# EAGLE schematic test (EAGLE 8.4.1)
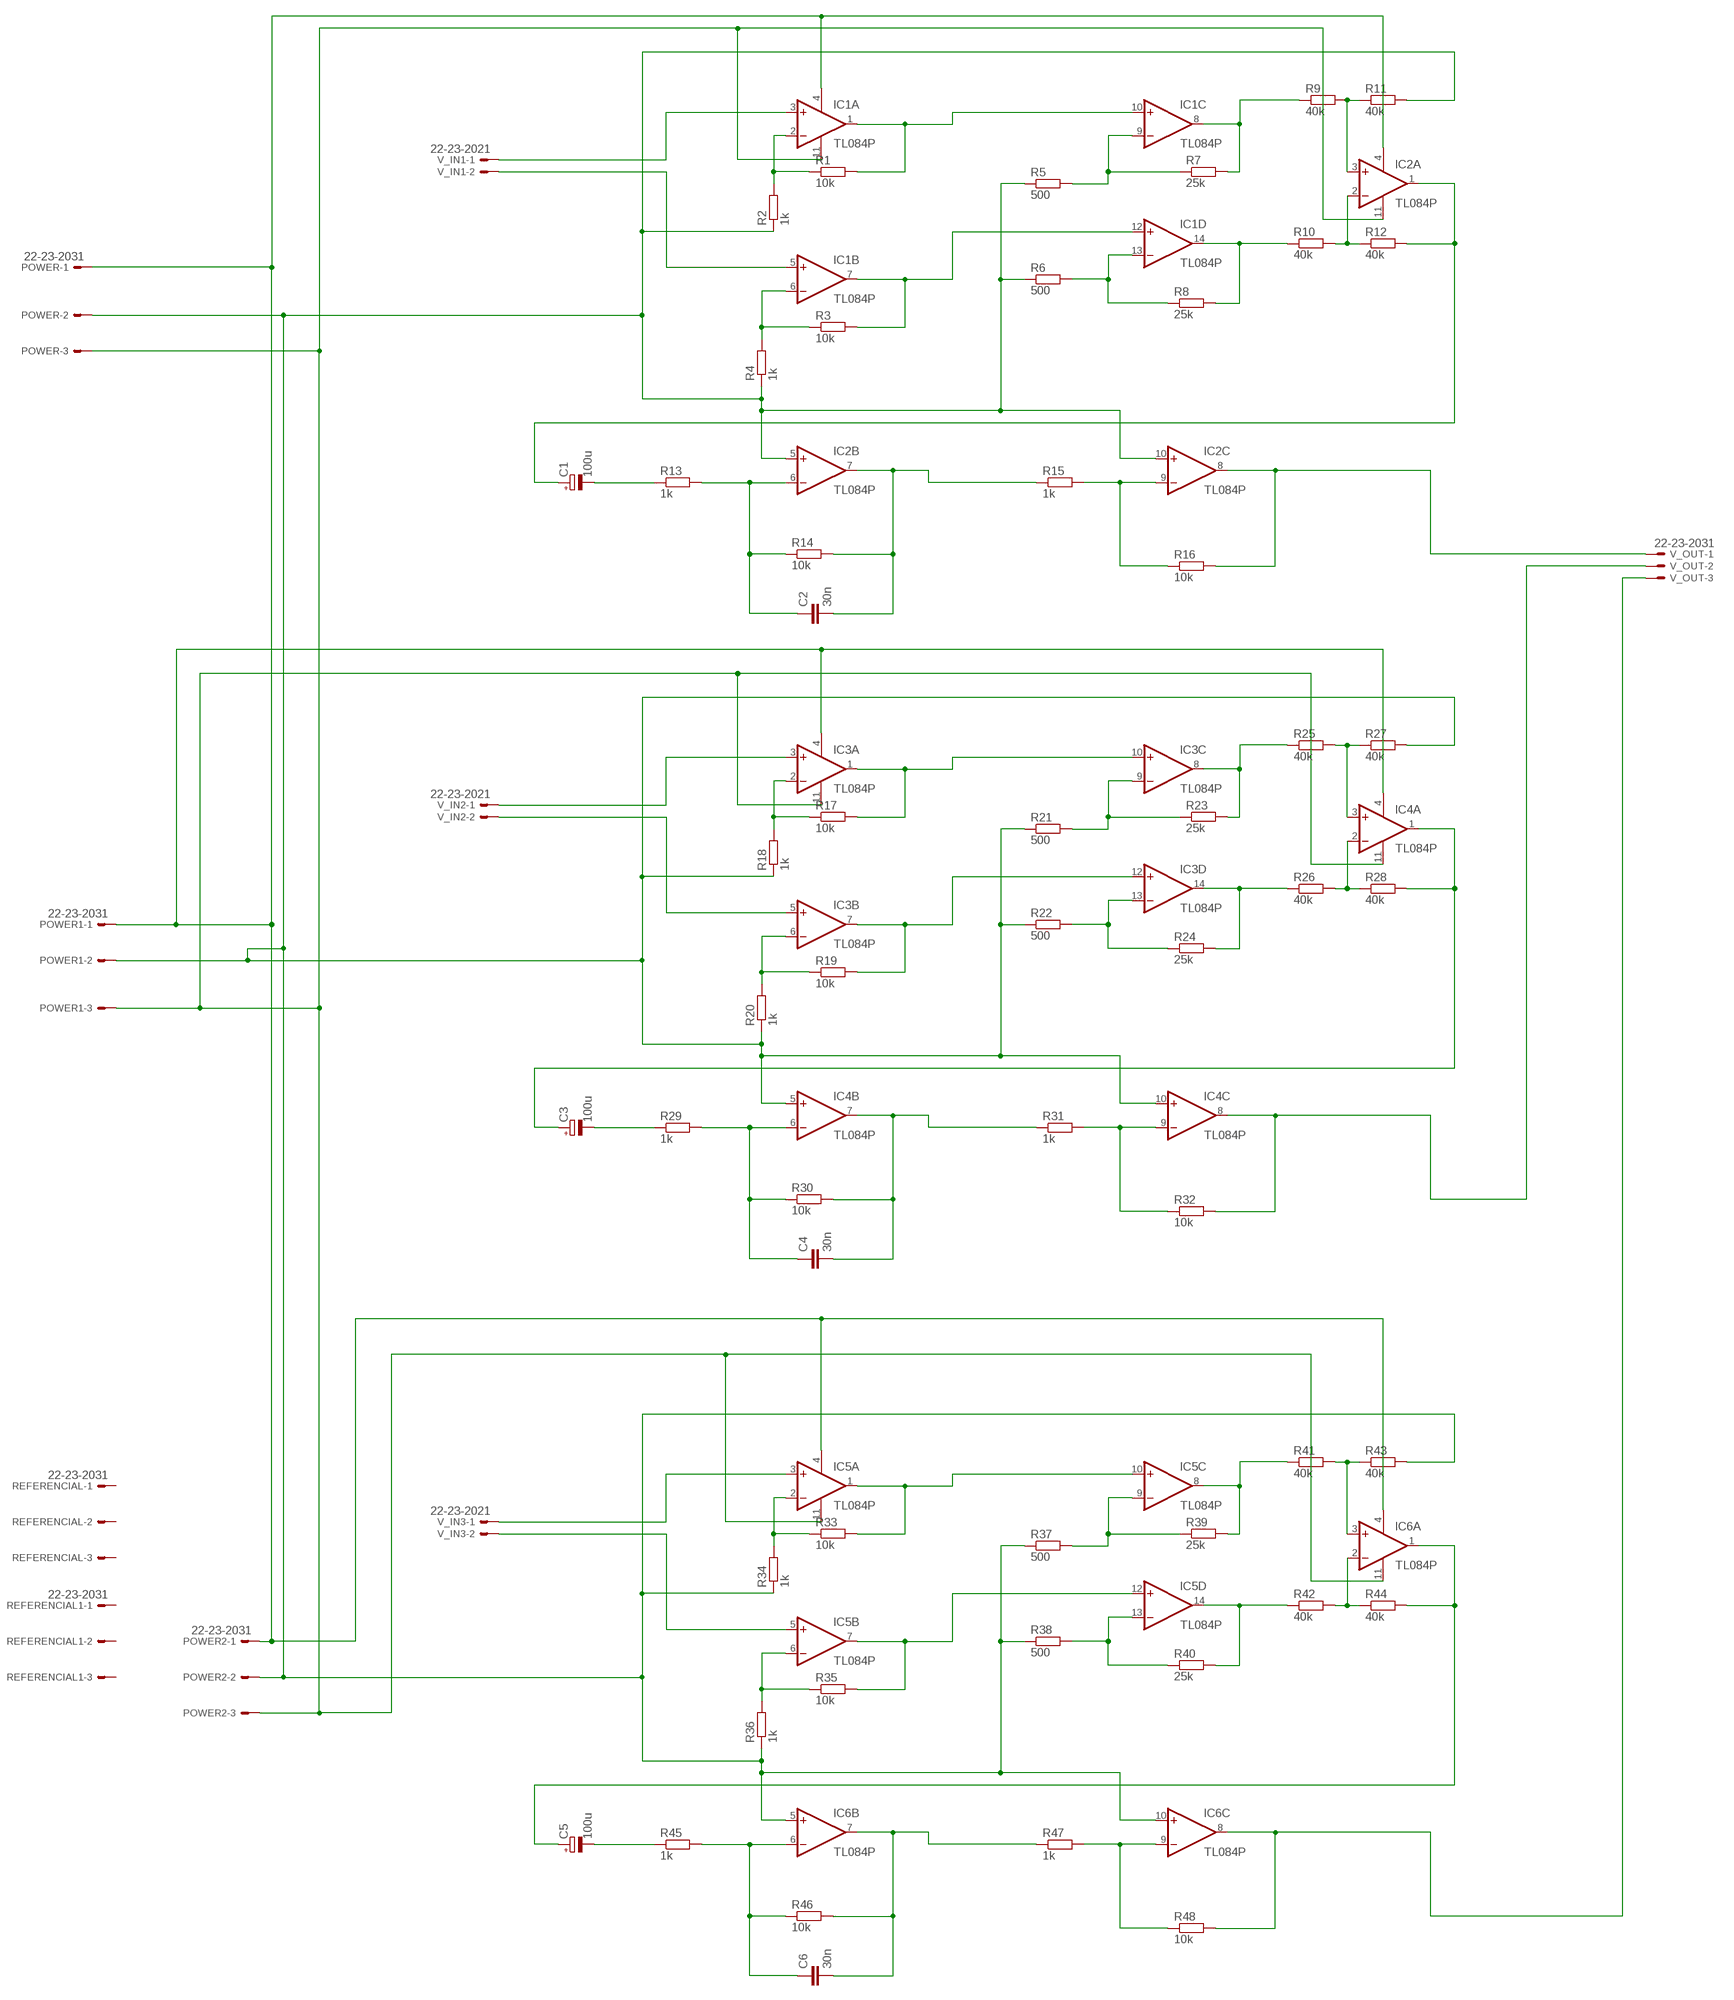
[diagram p0: schematic, sheet 1]

## Parts
C1  100u  CPOL-EUE3.5-8  [E3,5-8]
C2  30n  C-EU050-024X044  [C050-024X044]
C3  100u  CPOL-EUE3.5-8  [E3,5-8]
C4  30n  C-EU050-024X044  [C050-024X044]
C5  100u  CPOL-EUE3.5-8  [E3,5-8]
C6  30n  C-EU050-024X044  [C050-024X044]
IC1  TL084P  [DIL14]
IC2  TL084P  [DIL14]
IC3  TL084P  [DIL14]
IC4  TL084P  [DIL14]
IC5  TL084P  [DIL14]
IC6  TL084P  [DIL14]
POWER  22-23-2031  [22-23-2031]
POWER1  22-23-2031  [22-23-2031]
POWER2  22-23-2031  [22-23-2031]
R1  10k  R-EU_0207/10  [0207/10]
R2  1k  R-EU_0207/10  [0207/10]
R3  10k  R-EU_0207/10  [0207/10]
R4  1k  R-EU_0207/10  [0207/10]
R5  500  R-EU_0207/10  [0207/10]
R6  500  R-EU_0207/10  [0207/10]
R7  25k  R-EU_0207/10  [0207/10]
R8  25k  R-EU_0207/10  [0207/10]
R9  40k  R-EU_0207/10  [0207/10]
R10  40k  R-EU_0207/10  [0207/10]
R11  40k  R-EU_0207/10  [0207/10]
R12  40k  R-EU_0207/10  [0207/10]
R13  1k  R-EU_0207/10  [0207/10]
R14  10k  R-EU_0207/10  [0207/10]
R15  1k  R-EU_0207/10  [0207/10]
R16  10k  R-EU_0207/10  [0207/10]
R17  10k  R-EU_0207/10  [0207/10]
R18  1k  R-EU_0207/10  [0207/10]
R19  10k  R-EU_0207/10  [0207/10]
R20  1k  R-EU_0207/10  [0207/10]
R21  500  R-EU_0207/10  [0207/10]
R22  500  R-EU_0207/10  [0207/10]
R23  25k  R-EU_0207/10  [0207/10]
R24  25k  R-EU_0207/10  [0207/10]
R25  40k  R-EU_0207/10  [0207/10]
R26  40k  R-EU_0207/10  [0207/10]
R27  40k  R-EU_0207/10  [0207/10]
R28  40k  R-EU_0207/10  [0207/10]
R29  1k  R-EU_0207/10  [0207/10]
R30  10k  R-EU_0207/10  [0207/10]
R31  1k  R-EU_0207/10  [0207/10]
R32  10k  R-EU_0207/10  [0207/10]
R33  10k  R-EU_0207/10  [0207/10]
R34  1k  R-EU_0207/10  [0207/10]
R35  10k  R-EU_0207/10  [0207/10]
R36  1k  R-EU_0207/10  [0207/10]
R37  500  R-EU_0207/10  [0207/10]
R38  500  R-EU_0207/10  [0207/10]
R39  25k  R-EU_0207/10  [0207/10]
R40  25k  R-EU_0207/10  [0207/10]
R41  40k  R-EU_0207/10  [0207/10]
R42  40k  R-EU_0207/10  [0207/10]
R43  40k  R-EU_0207/10  [0207/10]
R44  40k  R-EU_0207/10  [0207/10]
R45  1k  R-EU_0207/10  [0207/10]
R46  10k  R-EU_0207/10  [0207/10]
R47  1k  R-EU_0207/10  [0207/10]
R48  10k  R-EU_0207/10  [0207/10]
REFERENCIAL  22-23-2031  [22-23-2031]
REFERENCIAL1  22-23-2031  [22-23-2031]
V_IN1  22-23-2021  [22-23-2021]
V_IN2  22-23-2021  [22-23-2021]
V_IN3  22-23-2021  [22-23-2021]
V_OUT  22-23-2031  [22-23-2031]

## Nets
N$1: IC1.2(A:-IN) R1.1 R2.2
N$2: IC1.1(A:OUT) IC1.10(C:+IN) R1.2
N$3: IC1.9(C:-IN) R5.2 R7.1
N$4: IC1.6(B:-IN) R3.1 R4.2
N$5: IC1.7(B:OUT) IC1.12(D:+IN) R3.2
N$6: IC1.13(D:-IN) R6.2 R8.1
N$7: IC1.14(D:OUT) R8.2 R10.1
N$8: IC1.8(C:OUT) R7.2 R9.1
N$9: IC2.2(A:-IN) R10.2 R12.1
N$10: IC2.3(A:+IN) R9.2 R11.1
N$11: C1.+ IC2.1(A:OUT) R12.2
N$12: C1.- R13.1
N$13: C2.1 IC2.6(B:-IN) R13.2 R14.1
N$14: C2.2 IC2.7(B:OUT) R14.2 R15.1
N$15: IC2.9(C:-IN) R15.2 R16.1
N$16: IC2.8(C:OUT) R16.2 V_OUT.1
N$17: IC1.3(A:+IN) V_IN1.1
N$19: IC1.5(B:+IN) V_IN1.2
N$21 [power]: IC1.4(P:V+) IC2.4(P:V+) IC3.4(P:V+) IC4.4(P:V+) IC5.4(P:V+) IC6.4(P:V+) POWER1.1 POWER2.1 POWER.1
N$25: IC3.2(A:-IN) R17.1 R18.2
N$26: IC3.1(A:OUT) IC3.10(C:+IN) R17.2
N$27: IC3.9(C:-IN) R21.2 R23.1
N$28: IC3.6(B:-IN) R19.1 R20.2
N$29: IC3.7(B:OUT) IC3.12(D:+IN) R19.2
N$30: IC3.13(D:-IN) R22.2 R24.1
N$31: IC3.14(D:OUT) R24.2 R26.1
N$32: IC3.8(C:OUT) R23.2 R25.1
N$33: IC4.2(A:-IN) R26.2 R28.1
N$34: IC4.3(A:+IN) R25.2 R27.1
N$35: C3.+ IC4.1(A:OUT) R28.2
N$36: C3.- R29.1
N$37: C4.1 IC4.6(B:-IN) R29.2 R30.1
N$38: C4.2 IC4.7(B:OUT) R30.2 R31.1
N$39: IC4.9(C:-IN) R31.2 R32.1
N$40: IC4.8(C:OUT) R32.2 V_OUT.2
N$41 [ground]: IC2.5(B:+IN) IC2.10(C:+IN) IC4.5(B:+IN) IC4.10(C:+IN) IC6.5(B:+IN) IC6.10(C:+IN) POWER1.2 POWER2.2 POWER.2 R2.1 R4.1 R5.1 R6.1 R11.2 R18.1 R20.1 R21.1 R22.1 R27.2 R34.1 R36.1 R37.1 R38.1 R43.2
N$42: IC3.3(A:+IN) V_IN2.1
N$43: IC3.5(B:+IN) V_IN2.2
N$44: IC5.2(A:-IN) R33.1 R34.2
N$45: IC5.1(A:OUT) IC5.10(C:+IN) R33.2
N$46: IC5.9(C:-IN) R37.2 R39.1
N$47: IC5.6(B:-IN) R35.1 R36.2
N$48: IC5.7(B:OUT) IC5.12(D:+IN) R35.2
N$49: IC5.13(D:-IN) R38.2 R40.1
N$50: IC5.14(D:OUT) R40.2 R42.1
N$51: IC5.8(C:OUT) R39.2 R41.1
N$52: IC6.2(A:-IN) R42.2 R44.1
N$53: IC6.3(A:+IN) R41.2 R43.1
N$54: C5.+ IC6.1(A:OUT) R44.2
N$55: C5.- R45.1
N$56: C6.1 IC6.6(B:-IN) R45.2 R46.1
N$57: C6.2 IC6.7(B:OUT) R46.2 R47.1
N$58: IC6.9(C:-IN) R47.2 R48.1
N$59: IC6.8(C:OUT) R48.2 V_OUT.3
N$60 [power]: IC1.11(P:V-) IC2.11(P:V-) IC3.11(P:V-) IC4.11(P:V-) IC5.11(P:V-) IC6.11(P:V-) POWER1.3 POWER2.3 POWER.3
N$61: IC5.3(A:+IN) V_IN3.1
N$62: IC5.5(B:+IN) V_IN3.2
Unconnected: IC2.12(D:+IN) IC2.13(D:-IN) IC2.14(D:OUT) IC4.12(D:+IN) IC4.13(D:-IN) IC4.14(D:OUT) IC6.12(D:+IN) IC6.13(D:-IN) IC6.14(D:OUT) REFERENCIAL1.1 REFERENCIAL1.2 REFERENCIAL1.3 REFERENCIAL.1 REFERENCIAL.2 REFERENCIAL.3

## Library data of the parts
C1 C3 C5 = rcl:CPOL-EU: POLARIZED CAPACITOR, European symbol
C2 C4 C6 = rcl:C-EU: CAPACITOR, European symbol
IC1-IC6 = linear2:TL084: OP AMP
POWER POWER1 POWER2 REFERENCIAL REFERENCIAL1 V_OUT = con-molex:22-23-2031: .100" (2.54mm) Center Header - 3 Pin; MF: MOLEX; MPN: 22-23-2031; OC_FARNELL: 1462950; OC_NEWARK: 30C0862
R1-R48 = resistor:R-EU_: RESISTOR, European symbol
V_IN1-V_IN3 = con-molex:22-23-2021: .100" (2.54mm) Center Header - 2 Pin; MF: MOLEX; MPN: 22-23-2021; OC_FARNELL: 1462926; OC_NEWARK: 25C3832

## Net classes
0 default: width 0.406 mm
1 ground: width 0.61 mm
2 power: width 0.508 mm